# Altium project FOC_BLDC.PrjPcb
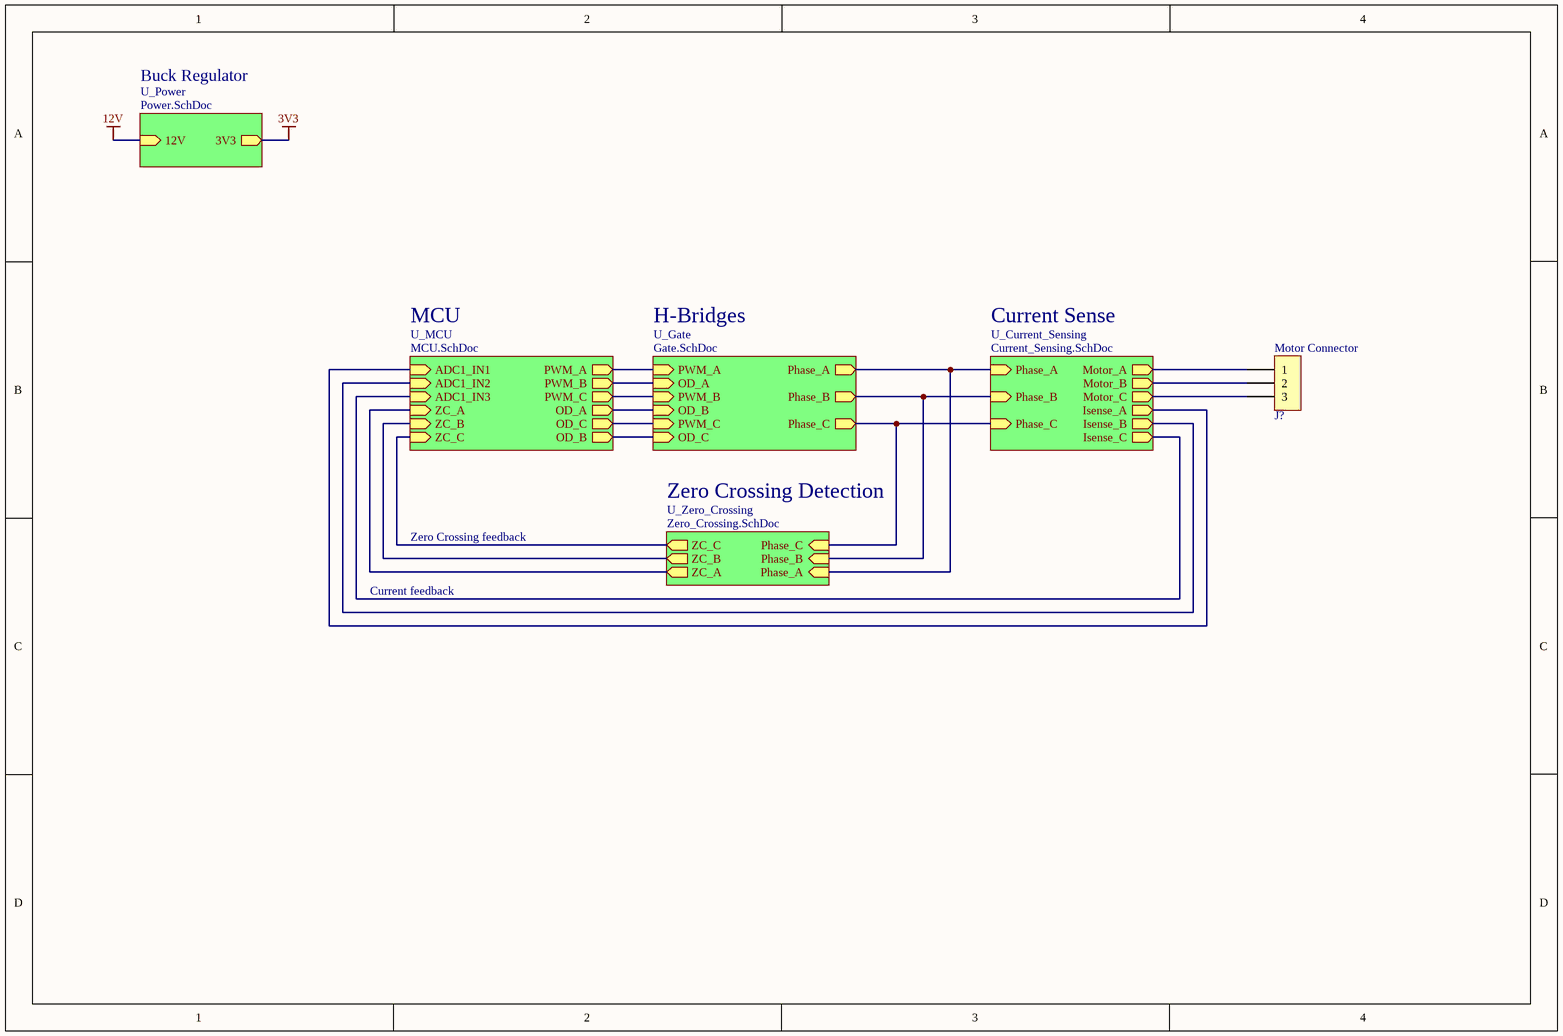
[diagram p0: Main.SchDoc]
6 sheets, 69 parts. Net scope: hierarchical (ports join the sheet entries above them; power ports are global).
Sheets:
  Main.SchDoc
    U_Power = Power.SchDoc
    U_Zero_Crossing = Zero_Crossing.SchDoc
    U_Current_Sensing = Current_Sensing.SchDoc
    U_MCU = MCU.SchDoc
    U_Gate = Gate.SchDoc

## Sheet Main.SchDoc
size A4; SheetNumber: 1; SheetTotal: 6

### Parts
J?  TB002-500-03BE  [TB002-500-03BE]  (value not drawn)

### Sub-sheets
U_Current_Sensing = Current_Sensing.SchDoc: Phase_A (in), Motor_A (out), Isense_A (out), Phase_B (in), Phase_C (in), Motor_B (out), Motor_C (out), Isense_B (out), Isense_C (out)
U_Gate = Gate.SchDoc: PWM_A (in), OD_A (in), Phase_A (out), PWM_B (in), OD_B (in), Phase_B (out), PWM_C (in), OD_C (in), Phase_C (out)
U_MCU = MCU.SchDoc: ADC1_IN1 (in), ADC1_IN2 (in), ADC1_IN3 (in), PWM_A (out), PWM_B (out), PWM_C (out), OD_A (out), OD_C (out), OD_B (out), ZC_A (in), ZC_B (in), ZC_C (in)
U_Power = Power.SchDoc: 12V (in), 3V3 (out)
U_Zero_Crossing = Zero_Crossing.SchDoc: Phase_A (in), Phase_B (in), Phase_C (in), ZC_A (out), ZC_B (out), ZC_C (out)

### Nets
NetC?#7_1: sheet U_Zero_Crossing/Phase_A, sheet U_Current_Sensing/Phase_A, sheet U_Gate/Phase_A
NetC?#9_1: sheet U_Zero_Crossing/Phase_B, sheet U_Current_Sensing/Phase_B, sheet U_Gate/Phase_B
NetC?#11_1: sheet U_Zero_Crossing/Phase_C, sheet U_Current_Sensing/Phase_C, sheet U_Gate/Phase_C
NetJ?_1: J?.1 ; sheet U_Current_Sensing/Motor_A
NetJ?_2: J?.2 ; sheet U_Current_Sensing/Motor_B
NetJ?_3: J?.3 ; sheet U_Current_Sensing/Motor_C
NetU?#2_1: sheet U_Zero_Crossing/ZC_A, sheet U_MCU/ZC_A
NetU?#3_2: sheet U_Zero_Crossing/ZC_B, sheet U_MCU/ZC_B
NetU?#4_13: sheet U_Zero_Crossing/ZC_C, sheet U_MCU/ZC_C
NetU?#7_1: sheet U_Current_Sensing/Isense_A, sheet U_MCU/ADC1_IN1
NetU?#10_1: sheet U_Current_Sensing/Isense_B, sheet U_MCU/ADC1_IN2
NetU?#12_1: sheet U_Current_Sensing/Isense_C, sheet U_MCU/ADC1_IN3
NetU?#17_2: sheet U_MCU/PWM_A, sheet U_Gate/PWM_A
NetU?#17_3: sheet U_MCU/PWM_B, sheet U_Gate/OD_A
NetU?#18_2: sheet U_MCU/PWM_C, sheet U_Gate/PWM_B
NetU?#18_3: sheet U_MCU/OD_A, sheet U_Gate/OD_B
NetU?#19_2: sheet U_MCU/OD_C, sheet U_Gate/PWM_C
NetU?#19_3: sheet U_MCU/OD_B, sheet U_Gate/OD_C

### Notes on the sheet
- Buck Regulator
- MCU
- H-Bridges
- Current Sense
- (near J?) Motor Connector
- Zero Crossing Detection
- Zero Crossing feedback
- Current feedback

### Library data of the parts
J? = 3PIN_CONNECTOR_5mm: 3 Position Wire to Board Terminal Block Horizontal with Board 0.197" (5.00mm) Through Hole

## Sheet Power.SchDoc
size A4; SheetNumber: 2; SheetTotal: 6
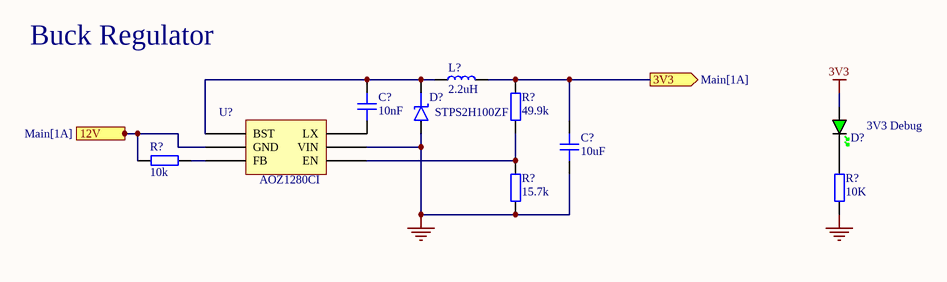
[diagram p1: Power.SchDoc]

### Parts
(Parts that share a designator on the sheet are numbered #1, #2 ... from top to bottom, then left to right.)
C?#1  10nF  [CAP_0402]
C?#2  10uF  [CAP_0402]
D?#1  STPS2H100ZF  [STPS2H100ZF]
D?#2  GREEN  [LED_0603_GREEN]  (value not drawn)
L?  2.2uH  [IND_2016]
R?#1  49.9k  [RES_0402]
R?#2  10k  [RES_0402]
R?#3  15.7k  [RES_0402]
R?#4  10K  [RES_0402]
U?#1  AOZ1280CI  [SOT95P280X125-6N]

### Ports
3V3 (out, see Main[1A]), 12V (in, see Main[1A])

### Nets
3V3: C?#2.1 D?#2.A L?.2 R?#1.2 ; port 3V3
12V: R?#2.1 U?#1.2(GND) ; port 12V
GND: C?#2.2 D?#1.A R?#3.1 R?#4.1 U?#1.5(VIN)
NetC?#1_1: C?#1.1 D?#1.K L?.1 U?#1.1(BST)
NetC?#1_2: C?#1.2 U?#1.6(LX)
NetD?#2_K: D?#2.K R?#4.2
NetR?#1_1: R?#1.1 R?#3.2 U?#1.4(EN)
NetR?#2_2: R?#2.2 U?#1.3(FB)

### Notes on the sheet
- Buck Regulator
- (near D?#2) 3V3 Debug

### Library data of the parts
C?#1 C?#2 = CAP_0402: Capacitor SMD 0402; Manufacturer: *; Manufacturer Part Number: *; Distributor Link: *; LCSC: *; Rating: *; Dielectric: *
D?#1 = D_SCHOTTKY_SOD_323: Diode Schottky SMD SOD-323
D?#2 = LED_0603_GREEN: LED 0603 GREEN SMD
L? = IND_1008: 2.2 µH Shielded Thin Film Inductor 2.5 A 87mOhm Max 0806 (2016 Metric); Supplier 1: Digikey; Supplier Part Number 1: 1276-6901-1-ND
R?#1-R?#4 = RES_0402: Resistor SMD 0402; Manufacturer: *; Manufacturer Part Number: *; Distributor Link: *; LCSC: *
U?#1 = CMP-002-000004-2: Buck Switching Regulator IC Positive Adjustable 0.8V 1 Output 1.2A SOT-23-6

## Sheet Zero_Crossing.SchDoc
size A4; SheetNumber: 6; SheetTotal: 7
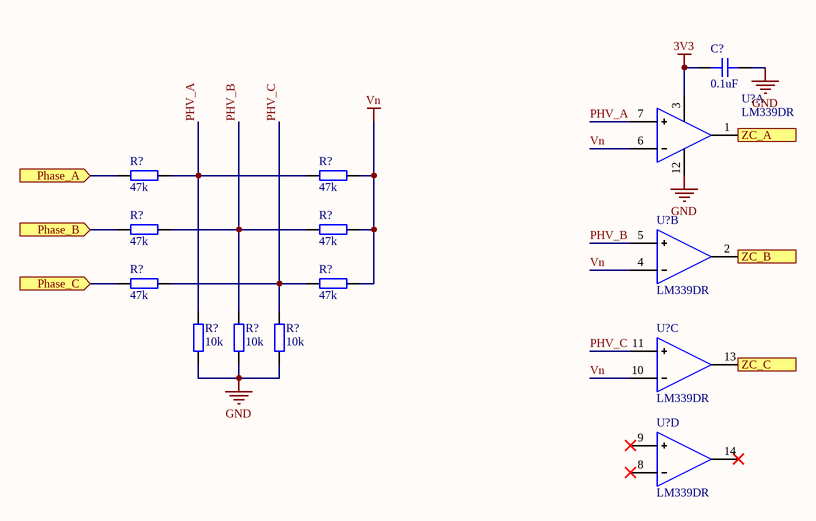
[diagram p2: Zero_Crossing.SchDoc]

### Parts
(Parts that share a designator on the sheet are numbered #1, #2 ... from top to bottom, then left to right.)
C?#3  0.1uF  [CAP_0402]
R?#5  47k  [RES_0402]
R?#6  47k  [RES_0402]
R?#7  47k  [RES_0402]
R?#8  47k  [RES_0402]
R?#9  47k  [RES_0402]
R?#10  47k  [RES_0402]
R?#11  10k  [RES_0402]
R?#12  10k  [RES_0402]
R?#13  10k  [RES_0402]
U?#2  LM339DR  [LM339DR]  (part A of 4)
U?#3  LM339DR  [LM339DR]  (part B of 4)
U?#4  LM339DR  [LM339DR]  (part C of 4)
U?#5  LM339DR  [LM339DR]  (part D of 4)

### Ports
Phase_A (in), Phase_B (in), Phase_C (in), ZC_A (out), ZC_B (out), ZC_C (out)

### Nets
3V3: C?#3.2 U?#2.3
GND: C?#3.1 R?#11.1 R?#12.1 R?#13.1 U?#2.12
Vn: R?#6.2 R?#8.2 R?#10.2 U?#2.6 U?#3.4 U?#4.10
PHV_A: R?#5.2 R?#6.1 R?#11.2 U?#2.7
PHV_B: R?#7.2 R?#8.1 R?#12.2 U?#3.5
PHV_C: R?#9.2 R?#10.1 R?#13.2 U?#4.11
NetC?#7_1: R?#5.1 ; port Phase_A
NetC?#9_1: R?#7.1 ; port Phase_B
NetC?#11_1: R?#9.1 ; port Phase_C
NetU?#2_1: U?#2.1 ; port ZC_A
NetU?#3_2: U?#3.2 ; port ZC_B
NetU?#4_13: U?#4.13 ; port ZC_C

Not connected (* = marked no-connect by the designer): U?#5 8* 9* 14*

### Library data of the parts
C?#3 = CAP_0402: Capacitor SMD 0402; Manufacturer: *; Manufacturer Part Number: *; Distributor Link: *; LCSC: *; Rating: *; Dielectric: *
R?#5-R?#13 = RES_0402: Resistor SMD 0402; Manufacturer: *; Manufacturer Part Number: *; Distributor Link: *; LCSC: *

## Sheet Current_Sensing.SchDoc
size A4; SheetNumber: 2; SheetTotal: 6
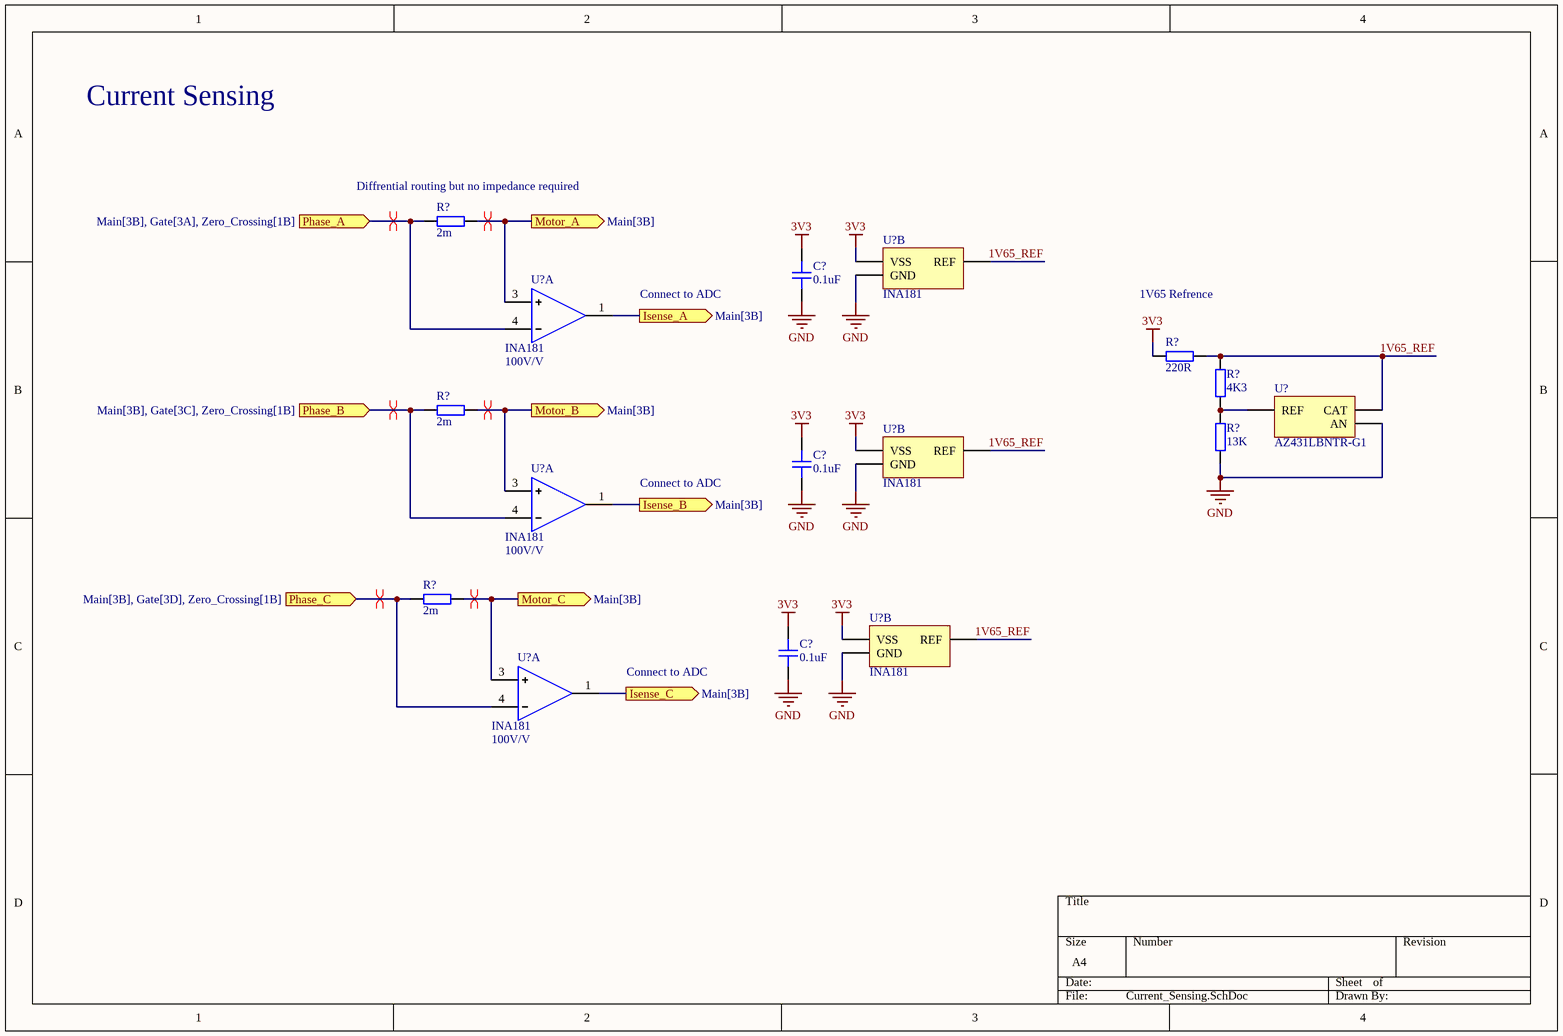
[diagram p3: Current_Sensing.SchDoc]

### Parts
(Parts that share a designator on the sheet are numbered #1, #2 ... from top to bottom, then left to right.)
C?#4  0.1uF  [CAP_0402]
C?#5  0.1uF  [CAP_0402]
C?#6  0.1uF  [CAP_0402]
R?#14  2m  [RES_0402]
R?#15  220R  [RES_0402]
R?#16  4K3  [RES_0402]
R?#17  2m  [RES_0402]
R?#18  13K  [RES_0402]
R?#19  2m  [RES_0402]
U?#6  INA181  [INA181]  (part B of 2)
U?#7  INA181  [INA181]  (part A of 2)
U?#8  AZ431LBNTR-G1  [SOT-23-3]
U?#9  INA181  [INA181]  (part B of 2)
U?#10  INA181  [INA181]  (part A of 2)
U?#11  INA181  [INA181]  (part B of 2)
U?#12  INA181  [INA181]  (part A of 2)

### Ports
Isense_A (out, see Main[3B]), Isense_B (out, see Main[3B]), Isense_C (out, see Main[3B]), Motor_A (out, see Main[3B]), Motor_B (out, see Main[3B]), Motor_C (out, see Main[3B]), Phase_A (in, see Main[3B], Gate[3A], Zero_Crossing[1B]), Phase_B (in, see Main[3B], Gate[3C], Zero_Crossing[1B]), Phase_C (in, see Main[3B], Gate[3D], Zero_Crossing[1B])

### Nets
3V3: C?#4.2 C?#5.2 C?#6.2 R?#15.2 U?#6.6(VSS) U?#9.6(VSS) U?#11.6(VSS)
GND: C?#4.1 C?#5.1 C?#6.1 R?#18.1 U?#6.2(GND) U?#8.3(AN) U?#9.2(GND) U?#11.2(GND)
1V65_REF: R?#15.1 R?#16.2 U?#6.5(REF) U?#8.2(CAT) U?#9.5(REF) U?#11.5(REF)
NetC?#7_1: R?#14.1 U?#7.4 ; port Phase_A
NetC?#9_1: R?#17.1 U?#10.4 ; port Phase_B
NetC?#11_1: R?#19.1 U?#12.4 ; port Phase_C
NetJ?_1: R?#14.2 U?#7.3 ; port Motor_A
NetJ?_2: R?#17.2 U?#10.3 ; port Motor_B
NetJ?_3: R?#19.2 U?#12.3 ; port Motor_C
NetR?#16_1: R?#16.1 R?#18.2 U?#8.1(REF)
NetU?#7_1: U?#7.1 ; port Isense_A
NetU?#10_1: U?#10.1 ; port Isense_B
NetU?#12_1: U?#12.1 ; port Isense_C

### Layout directives
differential pair: NetC?#7_1, NetC?#9_1, NetC?#11_1, NetJ?_1, NetJ?_2, NetJ?_3

### Notes on the sheet
- Current Sensing
- (near R?#14) Diffrential routing but no impedance required
- Connect to ADC
- 1V65 Refrence
- (near U?#7) 100V/V
- (near U?#10) 100V/V
- (near U?#12) 100V/V

### Library data of the parts
C?#4-C?#6 = CAP_0402: Capacitor SMD 0402; Manufacturer: *; Manufacturer Part Number: *; Distributor Link: *; LCSC: *; Rating: *; Dielectric: *
R?#14-R?#19 = RES_0402: Resistor SMD 0402; Manufacturer: *; Manufacturer Part Number: *; Distributor Link: *; LCSC: *
U?#8 = AZ431LBNTR-G1: IC VREF SHUNT ADJ 1% SOT23-3

## Sheet MCU.SchDoc
size A4; SheetNumber: 6; SheetTotal: 6
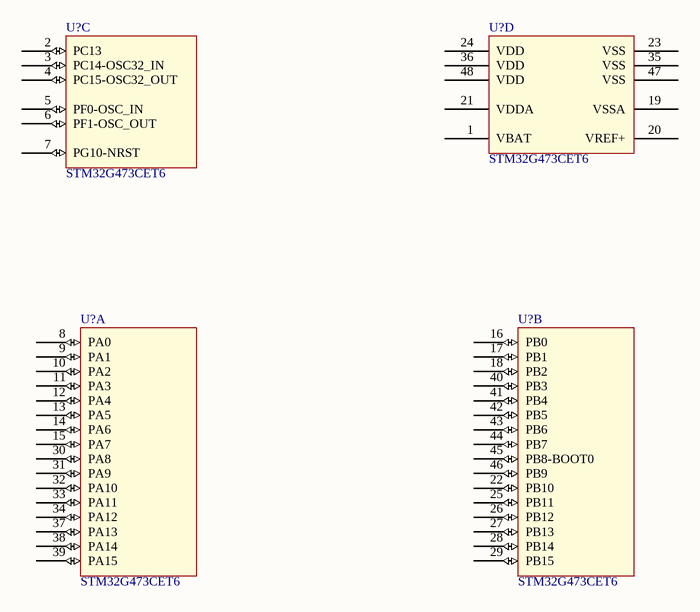
[diagram p4: MCU.SchDoc]

### Parts
(Parts that share a designator on the sheet are numbered #1, #2 ... from top to bottom, then left to right.)
U?#13  STM32G473CET6  [LQFP-48]  (part D of 4)
U?#14  STM32G473CET6  [LQFP-48]  (part C of 4)
U?#15  STM32G473CET6  [LQFP-48]  (part A of 4)
U?#16  STM32G473CET6  [LQFP-48]  (part B of 4)

### Nets

Not connected (* = marked no-connect by the designer): U?#13 1(VBAT) 19(VSSA) 20(VREF+) 21(VDDA) 23(VSS) 24(VDD) 35(VSS) 36(VDD) 47(VSS) 48(VDD); U?#14 2(PC13) 3(PC14-OSC32_IN) 4(PC15-OSC32_OUT) 5(PF0-OSC_IN) 6(PF1-OSC_OUT) 7(PG10-NRST); U?#15 8(PA0) 9(PA1) 10(PA2) 11(PA3) 12(PA4) 13(PA5) 14(PA6) 15(PA7) 30(PA8) 31(PA9) 32(PA10) 33(PA11) 34(PA12) 37(PA13) 38(PA14) 39(PA15); U?#16 16(PB0) 17(PB1) 18(PB2) 22(PB10) 25(PB11) 26(PB12) 27(PB13) 28(PB14) 29(PB15) 40(PB3) 41(PB4) 42(PB5) 43(PB6) 44(PB7) 45(PB8-BOOT0) 46(PB9)

### Library data of the parts
U?#13-U?#16 = STM32G473CET6: No Description Available; Mfr_Name: STMicroelectronics; RefDes: RefDes; Type: Type

## Sheet Gate.SchDoc
size A4; SheetNumber: 3; SheetTotal: 6
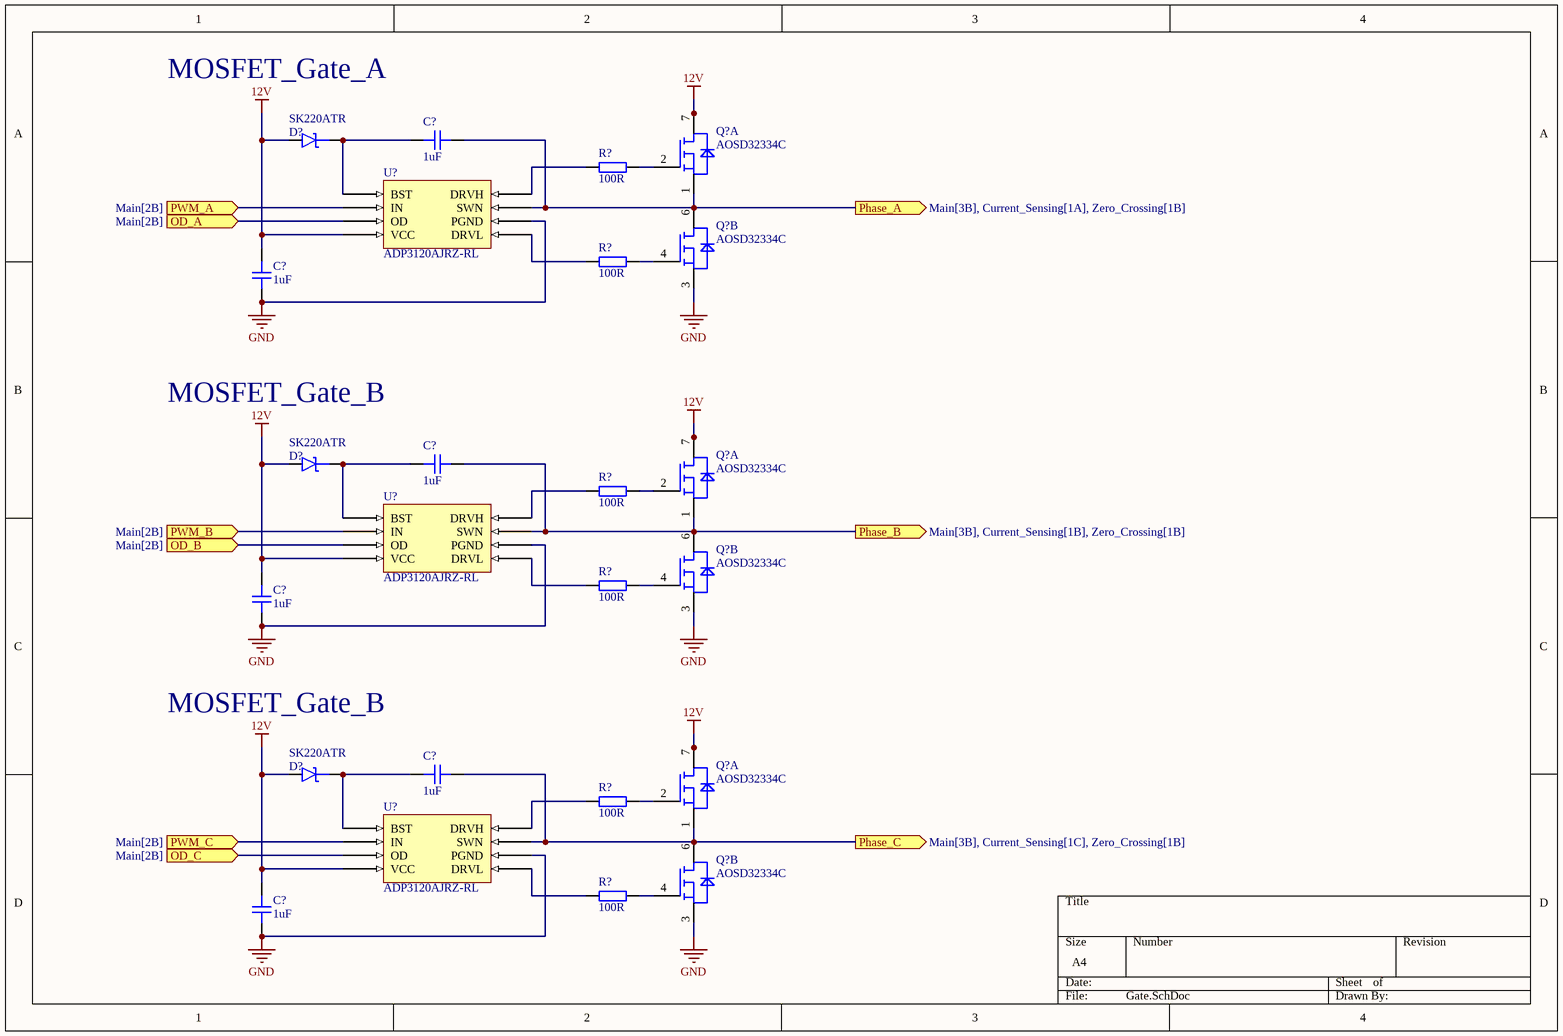
[diagram p5: Gate.SchDoc]

### Parts
(Parts that share a designator on the sheet are numbered #1, #2 ... from top to bottom, then left to right.)
C?#7  1uF  [CAP_0402]
C?#8  1uF  [CAP_0402]
C?#9  1uF  [CAP_0402]
C?#10  1uF  [CAP_0402]
C?#11  1uF  [CAP_0402]
C?#12  1uF  [CAP_0402]
D?#3  SK220ATR  [DO-214AC-2 (SMA)]
D?#4  SK220ATR  [DO-214AC-2 (SMA)]
D?#5  SK220ATR  [DO-214AC-2 (SMA)]
Q?#1  AOSD32334C  [SOIC-8]  (part A of 2)
Q?#2  AOSD32334C  [SOIC-8]  (part B of 2)
Q?#3  AOSD32334C  [SOIC-8]  (part A of 2)
Q?#4  AOSD32334C  [SOIC-8]  (part B of 2)
Q?#5  AOSD32334C  [SOIC-8]  (part A of 2)
Q?#6  AOSD32334C  [SOIC-8]  (part B of 2)
R?#20  100R  [RES_0402]
R?#21  100R  [RES_0402]
R?#22  100R  [RES_0402]
R?#23  100R  [RES_0402]
R?#24  100R  [RES_0402]
R?#25  100R  [RES_0402]
U?#17  ADP3120AJRZ-RL  [SOIC127P600X175-8N]
U?#18  ADP3120AJRZ-RL  [SOIC127P600X175-8N]
U?#19  ADP3120AJRZ-RL  [SOIC127P600X175-8N]

### Ports
OD_A (in, see Main[2B]), OD_B (in, see Main[2B]), OD_C (in, see Main[2B]), Phase_A (out, see Main[3B], Current_Sensing[1A], Zero_Crossing[1B]), Phase_B (out, see Main[3B], Current_Sensing[1B], Zero_Crossing[1B]), Phase_C (out, see Main[3B], Current_Sensing[1C], Zero_Crossing[1B]), PWM_A (in, see Main[2B]), PWM_B (in, see Main[2B]), PWM_C (in, see Main[2B])

### Nets
12V: C?#8.2 C?#10.2 C?#12.2 D?#3.A D?#4.A D?#5.A Q?#1.7 Q?#1.8 Q?#3.7 Q?#3.8 Q?#5.7 Q?#5.8 U?#17.4(VCC) U?#18.4(VCC) U?#19.4(VCC)
GND: C?#8.1 C?#10.1 C?#12.1 Q?#2.3 Q?#4.3 Q?#6.3 U?#17.6(PGND) U?#18.6(PGND) U?#19.6(PGND)
NetC?#7_1: C?#7.1 Q?#1.1 Q?#2.5 Q?#2.6 U?#17.7(SWN) ; port Phase_A
NetC?#7_2: C?#7.2 D?#3.K U?#17.1(BST)
NetC?#9_1: C?#9.1 Q?#3.1 Q?#4.5 Q?#4.6 U?#18.7(SWN) ; port Phase_B
NetC?#9_2: C?#9.2 D?#4.K U?#18.1(BST)
NetC?#11_1: C?#11.1 Q?#5.1 Q?#6.5 Q?#6.6 U?#19.7(SWN) ; port Phase_C
NetC?#11_2: C?#11.2 D?#5.K U?#19.1(BST)
NetQ?#1_2: Q?#1.2 R?#20.2
NetQ?#2_4: Q?#2.4 R?#21.2
NetQ?#3_2: Q?#3.2 R?#22.2
NetQ?#4_4: Q?#4.4 R?#23.2
NetQ?#5_2: Q?#5.2 R?#24.2
NetQ?#6_4: Q?#6.4 R?#25.2
NetR?#20_1: R?#20.1 U?#17.8(DRVH)
NetR?#21_1: R?#21.1 U?#17.5(DRVL)
NetR?#22_1: R?#22.1 U?#18.8(DRVH)
NetR?#23_1: R?#23.1 U?#18.5(DRVL)
NetR?#24_1: R?#24.1 U?#19.8(DRVH)
NetR?#25_1: R?#25.1 U?#19.5(DRVL)
NetU?#17_2: U?#17.2(IN) ; port PWM_A
NetU?#17_3: U?#17.3(OD) ; port OD_A
NetU?#18_2: U?#18.2(IN) ; port PWM_B
NetU?#18_3: U?#18.3(OD) ; port OD_B
NetU?#19_2: U?#19.2(IN) ; port PWM_C
NetU?#19_3: U?#19.3(OD) ; port OD_C

### Notes on the sheet
- MOSFET_Gate_A
- MOSFET_Gate_B

### Library data of the parts
C?#7-C?#12 = CAP_0402: Capacitor SMD 0402; Manufacturer: *; Manufacturer Part Number: *; Distributor Link: *; LCSC: *; Rating: *; Dielectric: *
D?#3-D?#5 = D_SCHOTTKY_SMA: Diode Schottky SMD SMA (DO-214AA)
R?#20-R?#25 = RES_0402: Resistor SMD 0402; Manufacturer: *; Manufacturer Part Number: *; Distributor Link: *; LCSC: *
U?#17-U?#19 = CMP-00000-1: Half Bridge Based MOSFET Driver, PDSO8; Turn-On Delay Time: 0.045us; Channels: 1; Turn-Off Delay Time: 0.07us; Qualification Status: Not Qualified; Power Supplies: 12V; Min Supply Voltage: 4.6V; Package Body Material: Plastic; Package Equivalence Code: SOP8,.25; Time @ Peak Reflow Temperature-Max (s): 40s; High Side Driver: Yes; Max Supply Voltage: 13.2V; Case/Package: SOP; Peak Reflow Temperature (Cel): 260°C; Terminal Pitch: 1.27mm; JESD-609 Code: e3; Surface Mount: Yes; Temperature Grade: OTHER; Pins: 8; Reach SVHC Compliant: Yes; RoHS Compliant: Yes; Nominal Supply Voltage: 12V; Width: 3.9mm; JESD-30 Code: R-PDSO-G8; Package Style: SMALL OUTLINEMeter; Terminal Finish: Tin; Length: 4.9mm; Height - Seated (Max): 1.75mm; Min Operating Temperature: 0°C; Max Operating Temperature: 85°C; Terminal Position: DUAL; Interface IC Type: HALF BRIDGE BASED MOSFET DRIVER; Terminal Form: Gull Wing; Moisture Sensitivity Level: 1; Package Shape: Rectangular

## Nets that join several sheets
3V3: Power (C?#2.1 D?#2.A L?.2 R?#1.2), Zero_Crossing (C?#3.2 U?#2.3), Current_Sensing (7 pins)
12V: Power (R?#2.1 U?#1.2), Gate (15 pins)
GND: Power (5 pins), Zero_Crossing (5 pins), Current_Sensing (8 pins), Gate (9 pins)
NetC?#7_1: Zero_Crossing (R?#5.1), Current_Sensing (R?#14.1 U?#7.4), Gate (5 pins)
NetC?#9_1: Zero_Crossing (R?#7.1), Current_Sensing (R?#17.1 U?#10.4), Gate (5 pins)
NetC?#11_1: Zero_Crossing (R?#9.1), Current_Sensing (R?#19.1 U?#12.4), Gate (5 pins)
NetJ?_1: Main (J?.1), Current_Sensing (R?#14.2 U?#7.3)
NetJ?_2: Main (J?.2), Current_Sensing (R?#17.2 U?#10.3)
NetJ?_3: Main (J?.3), Current_Sensing (R?#19.2 U?#12.3)